# EAGLE design clock-kit-board (EAGLE 8.5.2)
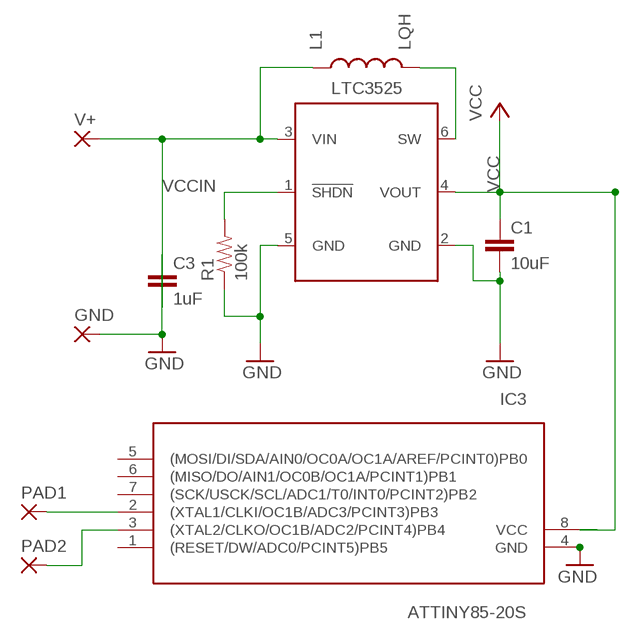
[diagram p0: schematic, sheet 1]

## Parts
C1  10uF  CAP0805  [0805]
C3  1uF  CAP0805  [0805]
GND  SMD5  [SMD2,54-5,08]
IC3  ATTINY85-20S  ATTINY85V-10S  [SOIC8]
L1  LQH  [LQH32]
PAD1  2,54/1,1  [2,54/1,1]
PAD2  2,54/1,1  [2,54/1,1]
R1  100k  RESISTOR0805-RES  [0805]
U1  LTC3525  [SC70-6L]
V+  SMD5  [SMD2,54-5,08]

## Nets
GND: C1.2 C3.1 GND.1(P) IC3.4(GND) R1.1 U1.2(GND) U1.5(GND)
N$1: L1.2 U1.6(SW)
N$2: IC3.2((XTAL1/CLKI/OC1B/ADC3/PCINT3)PB3) PAD1.1(P)
N$3: IC3.3((XTAL2/CLKO/OC1B/ADC2/PCINT4)PB4) PAD2.1(P)
SW: R1.2 U1.1(!SHDN)
VCC: C1.1 IC3.8(VCC) U1.4(VOUT)
VCCIN: C3.2 L1.1 U1.3(VIN) V+.1(P)
Unconnected: IC3.1((RESET/DW/ADC0/PCINT5)PB5) IC3.5((MOSI/DI/SDA/AIN0/OC0A/OC1A/AREF/PCINT0)PB0) IC3.6((MISO/DO/AIN1/OC0B/OC1A/PCINT1)PB1) IC3.7((SCK/USCK/SCL/ADC1/T0/INT0/PCINT2)PB2)

## Library data of the parts
C1 C3 = 0-SparkFun:CAP: Capacitor Standard 0603 ceramic capacitor, and 0.1" leaded capacitor.
GND V+ = wirepad:SMD5: SMD PAD
IC3 = avr:ATTINY85: MICROCONTROLLER 8 Kbytes FLASH 512 bytes EEPROM 512 bytes RAM 4-channel 10 bit ADC USI
L1 = murata-inductor:LQH: Murata LQH32 inductor
PAD1 PAD2 = wirepad:2,54/1,1: THROUGH-HOLE PAD
R1 = 0-SparkFun:RESISTOR: Resistor Basic schematic elements and footprints for 0603, 1206, and PTH resistors.
U1 = bicyclelab:LTC3525

## Board
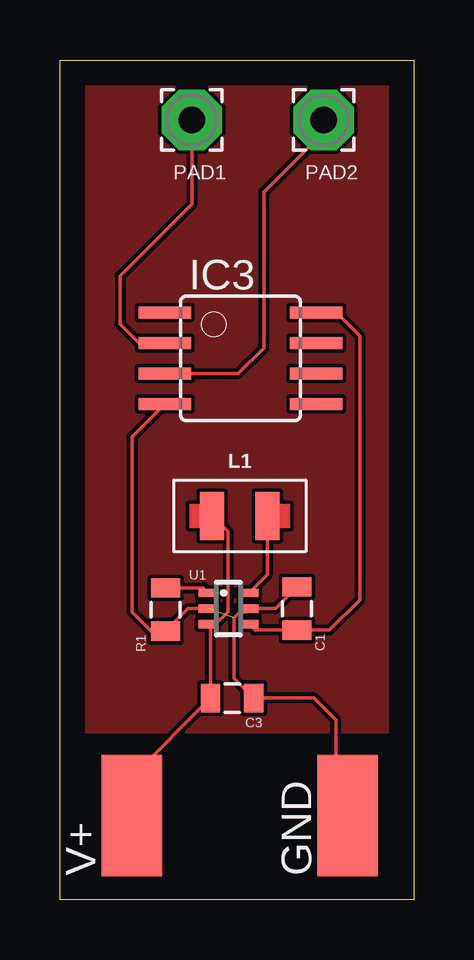
[diagram p1: board, top side]

Size 14.75 x 35 mm. Coordinates in mm from the lower left corner, seen from the top.
Outline: 0,35 14.75,35 14.75,0 0,0 0,35
Copper layers (1*16): Top 0.035mm / dielectric 1.5mm / Bottom 0.035mm
Design rules "default": minimum track width 6mil, minimum drill 0.35mm, track to track 6mil, track to pad 6mil, pad to pad 6mil, via to via 6mil, smd to smd 6mil, copper to edge 40mil, drill to drill 6mil, minimum pad ring 10mil, minimum via ring 8mil, stop-mask expansion 4mil, vias tented up to drill 0mil, thermal gap 10mil

### Footprints (pad centres in the part's own frame; a part is rotated, then mirrored left to right if it is on the bottom)
0805 = smd 0.8 x 1.2: 1 -0.9,0; 2 0.9,0
SMD2,54-5,08 = smd 2.54 x 5.08: 1 0,0
SOIC8 = smd 0.5 x 2.2: 1 -1.905,-3.154; 2 -0.645,-3.154; 3 0.625,-3.154; 4 1.895,-3.154; 5 1.905,3.154; 6 0.635,3.154; 7 -0.635,3.154; 8 -1.905,3.154
LQH32 = smd 1 x 2: 1 -1.15,0; 2 1.15,0
2,54/1,1 = drill 1.118 pad 2.54 octagon: 1 0,0
SC70-6L = smd 0.35 x 0.8: 1 -0.65,-0.85; 2 0,-0.85; 3 0.65,-0.85; 4 0.65,0.85; 5 0,0.85; 6 -0.65,0.85

### Placement (x,y rotation side)
C1  9.88,12.13 90 top
C3  7.18,8.4 180 top
GND  12,3.5 0 top
IC3  7.53,22.56 270 top
L1  7.5,16 0 top
PAD1  5.5,32.5 0 top
PAD2  11,32.5 0 top
R1  4.41,12.09 90 top
U1  7.03,12.13 270 top
V+  3,3.5 0 top

### Tracks (layer width: path | path; a pad name or v marks a point on that pad's centre or on a via)
GND  (1 unrouted)
  Top 0.152: U1.2 5.35,12.13 R1.1 3.81,11.19 3,12 3,19.29 IC3.4 | C1.2 8.98,12.13 U1.5 7.75,12 7.5,12 7.25,11.75 7.25,9.23 C3.1 10.6,8.4 11.5,7.5 11.5,4 GND.1
N$1
  Top 0.152: L1.2 8.65,13.55 U1.6
N$2
  Top 0.152: PAD1.1 5.5,29 2.5,26 2.5,24 3.29,23.2 IC3.2
N$3
  Top 0.152: IC3.3 7.43,21.93 8.5,23 8.5,29.5 11,32 PAD2.1
N$4
  pour Top: 0.5,34.5 0.5,7 14,7 14,34.5
SW
  Top 0.152: R1.2 5.97,12.99 U1.1
VCC
  Top 0.152: U1.4 8.13,11.23 C1.1 11.23,11.23 12.5,12.5 12.5,23.5 11.54,24.46 IC3.8
VCCIN
  Top 0.152: L1.1 7,15.35 7,12 6.48,11.48 U1.3 6.28,11.38 C3.2 3,5.12 V+.1